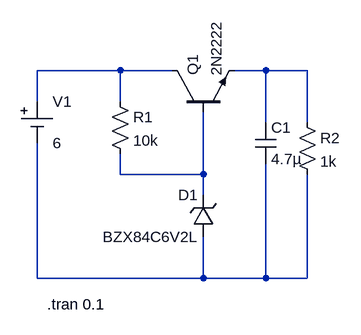
[diagram p0: schematic Draft1.asc]
Draft1.asc, the LTspice schematic file:
Version 4
SHEET 1 880 680
WIRE -64 144 -192 144
WIRE 16 144 -64 144
WIRE 160 144 112 144
WIRE 224 144 160 144
WIRE -192 192 -192 144
WIRE -64 192 -64 144
WIRE 160 224 160 144
WIRE 224 224 224 144
WIRE -64 304 -64 272
WIRE 64 304 64 208
WIRE 64 304 -64 304
WIRE 64 336 64 304
WIRE -192 464 -192 256
WIRE 64 464 64 400
WIRE 64 464 -192 464
WIRE 160 464 160 288
WIRE 160 464 64 464
WIRE 224 464 224 304
WIRE 224 464 160 464
SYMBOL npn 16 208 R270
SYMATTR InstName Q1
SYMATTR Value 2N2222
SYMBOL zener 80 400 R180
WINDOW 0 24 64 Left 2
WINDOW 3 24 0 Left 2
SYMATTR InstName D1
SYMATTR Value BZX84C6V2L
SYMBOL res -80 176 R0
SYMATTR InstName R1
SYMATTR Value 10k
SYMBOL res 208 208 R0
SYMATTR InstName R2
SYMATTR Value 1k
SYMBOL Misc/cell -192 192 R0
SYMATTR InstName V1
SYMATTR Value 6
SYMBOL cap 144 224 R0
SYMATTR InstName C1
SYMATTR Value 4.7µ
TEXT -176 504 Left 2 !.tran 0.1

The netlist it stands for:
* Draft1.asc
Q1 N001 N003 N002 0 2N2222
D1 N004 N003 BZX84C6V2L
R1 N001 N003 10k
R2 N002 N004 1k
V1 N001 N004 6
C1 N002 N004 4.7µ
.model D D
.lib standard.dio
.model NPN NPN
.model PNP PNP
.lib standard.bjt
.tran 0.1
.backanno
.end